# Altium schematic sheet JTAG_Flash_Update.SchDoc
size 420 x 297 mm; CompanyName: WUT ISE; Organization: WUT ISE; DocumentNumber: 11; SheetNumber: 9; Title2: JTAG, Flash & update interface; EDA_Number: ARTIQ; ModifiedDate: -
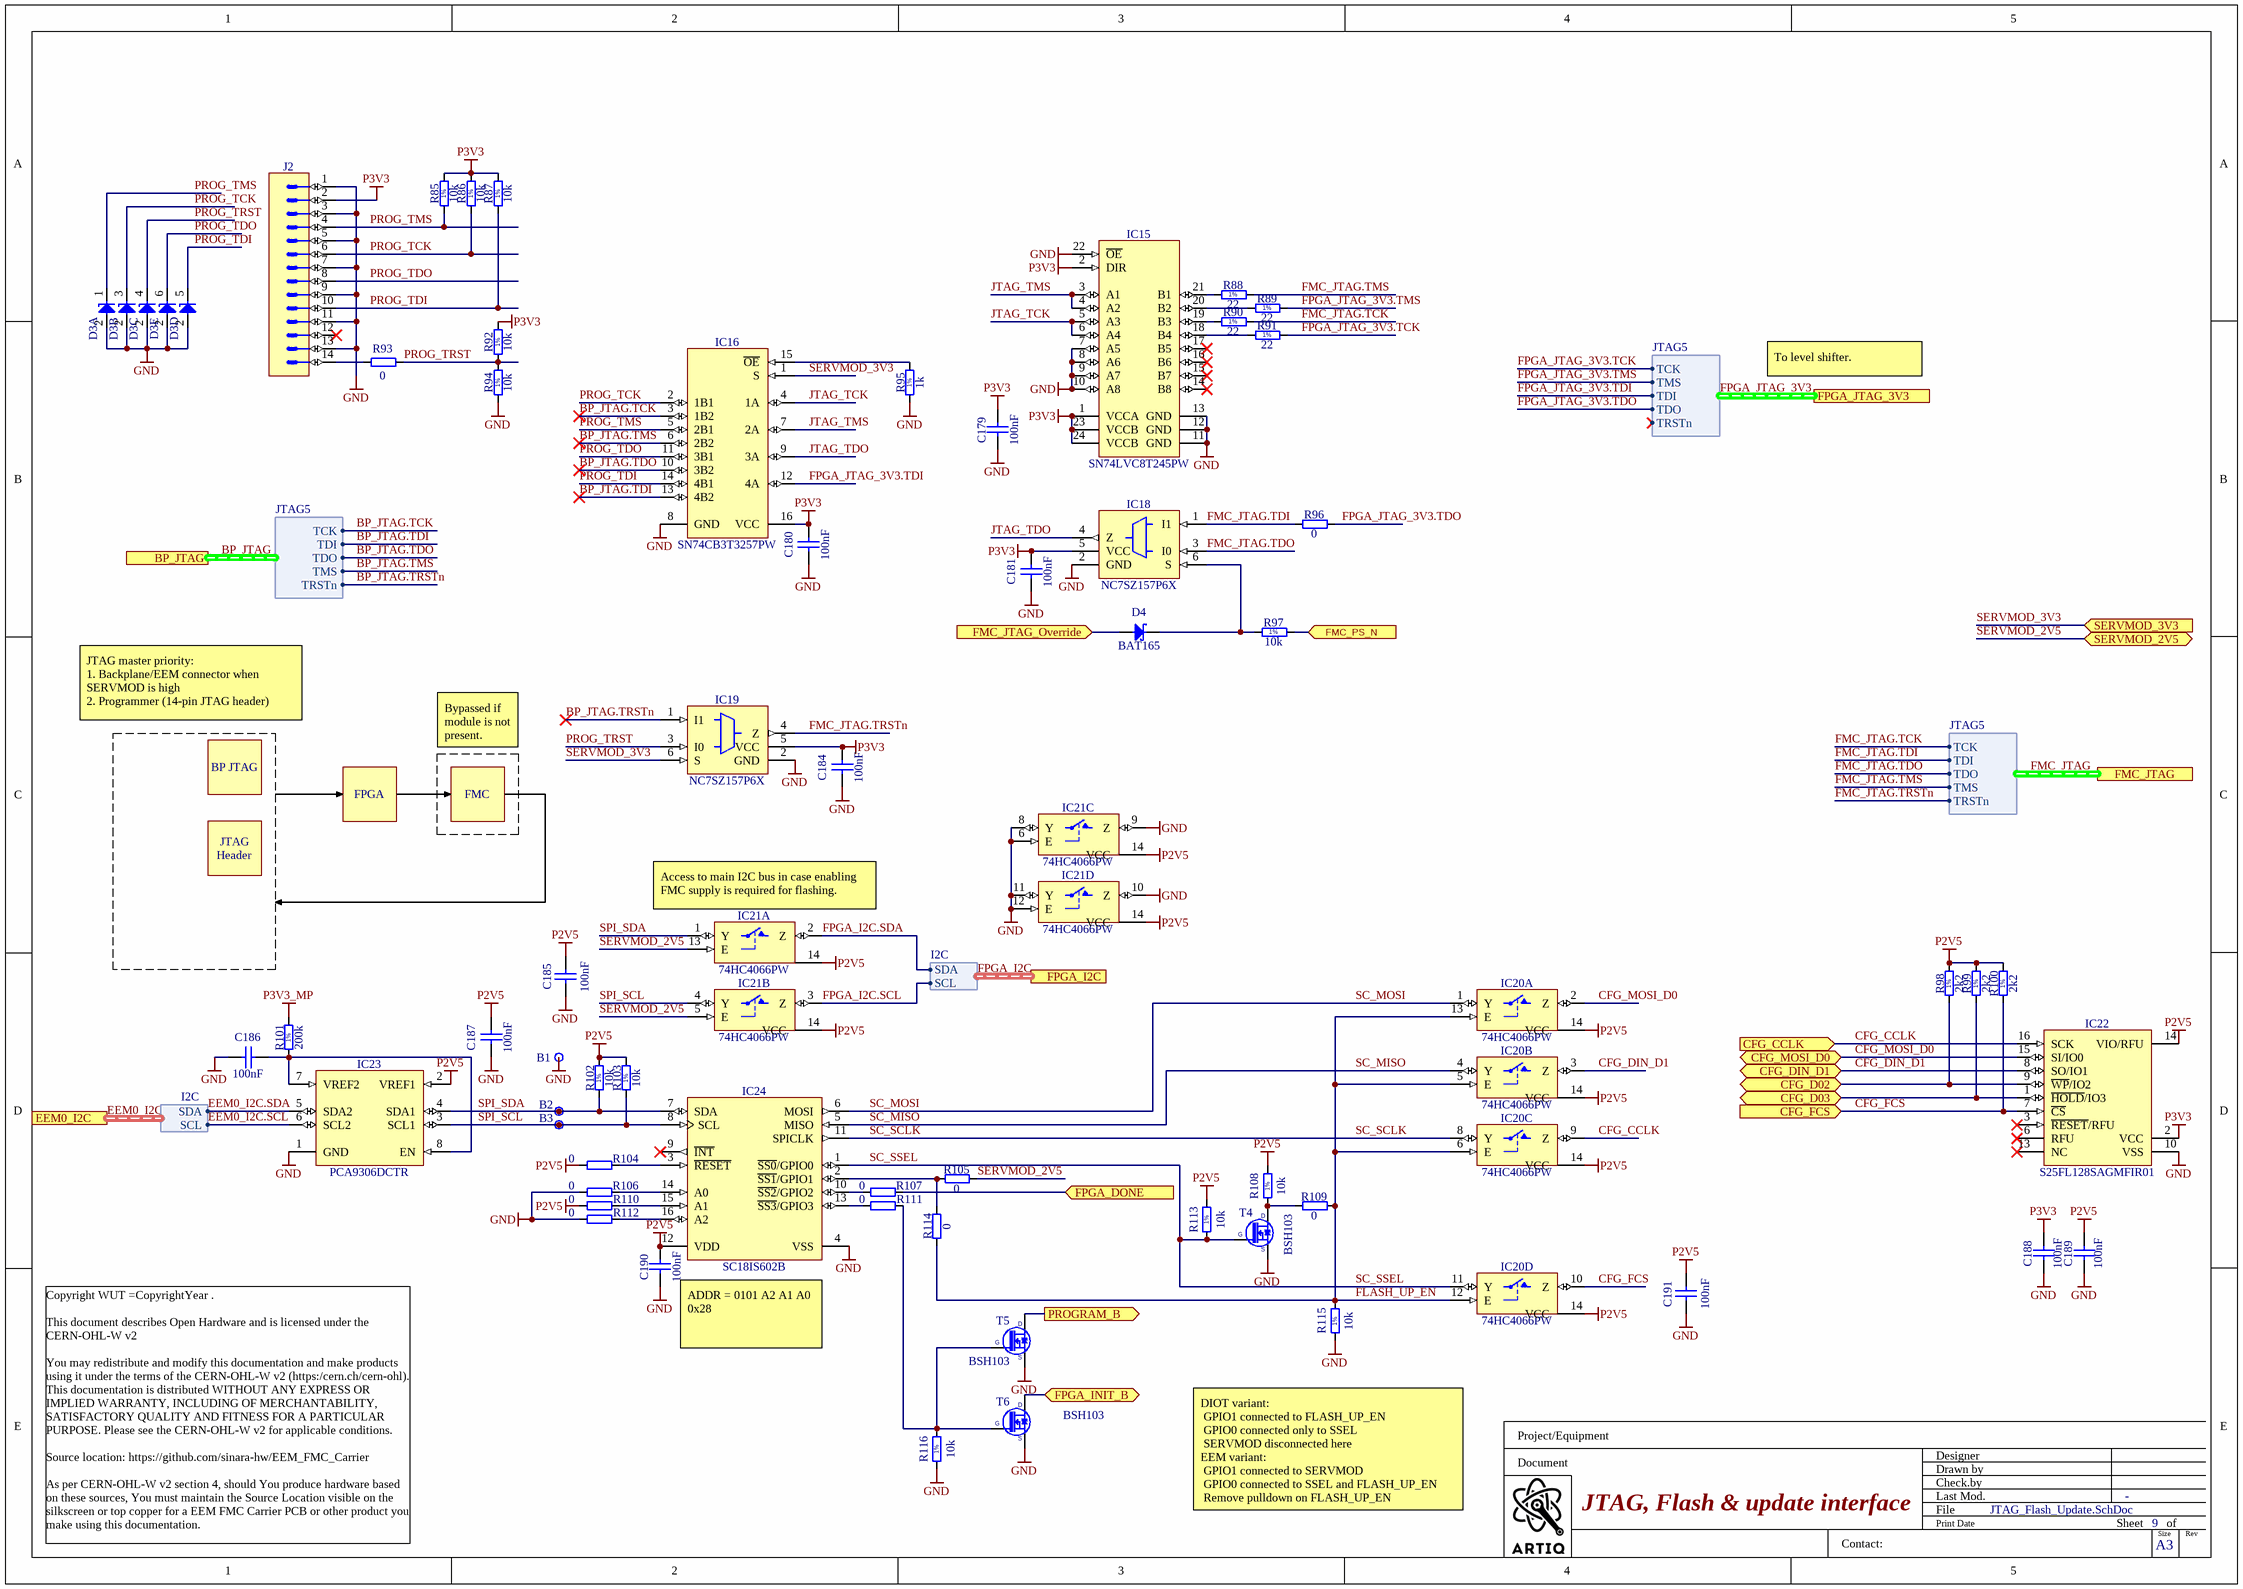
[diagram p0: JTAG_Flash_Update.SchDoc]

## Parts
B1  Plated Hole  [c150h100]  (value not drawn)  (no BOM)
B2  Test Point  [TPS127]  (value not drawn)  (no BOM)
B3  Test Point  [TPS127]  (value not drawn)  (no BOM)
C179  100nF  [CAPC1005X55N]
C180  100nF  [CAPC1005X55N]
C181  100nF  [CAPC1005X55N]
C184  100nF  [CAPC1005X55N]
C185  100nF  [CAPC1005X55N]
C186  100nF  [CAPC1005X55N]
C187  100nF  [CAPC1005X55N]
C188  100nF  [CAPC0603X33N]
C189  100nF  [CAPC0603X33N]
C190  100nF  [CAPC1005X55N]
C191  100nF  [CAPC1005X55N]
D3  PESD3V3L5UY  [SOT65P210X110-6N]  (value not drawn)  (parts A,B,C,D,E of 5)
D4  BAT165  [SOD2512X110N]
IC15  SN74LVC8T245PW  [SOP65P640X120-24N]
IC16  SN74CB3T3257PW  [SOP65P640X120-16N]
IC18  NC7SZ157P6X  [SOT65P210X110-6N]
IC19  NC7SZ157P6X  [SOT65P210X110-6N]
IC20  74HC4066PW  [SOP65P640X110-14N]  (parts A,B,C,D of 4)
IC21  74HC4066PW  [SOP65P640X110-14N]  (parts A,B,C,D of 4)
IC22  S25FL128SAGMFIR01  [SOIC127P1030X265-16N]
IC23  PCA9306DCTR  [SOP65P400X130-8N]
IC24  SC18IS602B  [SOP65P640X110-16N]
J2  Milli-Grid™  [MOLEX_87832-1420]  (value not drawn)
R85  10k  [RESC1005X40N]
R86  10k  [RESC1005X40N]
R87  10k  [RESC1005X40N]
R88  22  [RESC1005X40N]
R89  22  [RESC1005X40N]
R90  22  [RESC1005X40N]
R91  22  [RESC1005X40N]
R92  10k  [RESC1005X40N]
R93  0  [RESC1005X40N]
R94  10k  [RESC1005X40N]
R95  1k  [RESC1005X40N]
R96  0  [RESC1005X40N]
R97  10k  [RESC1005X40N]
R98  2k2  [RESC1005X40N]
R99  2k2  [RESC1005X40N]
R100  2k2  [RESC1005X40N]
R101  200k  [RESC1005X40N]
R102  10k  [RESC1005X40N]
R103  10k  [RESC1005X40N]
R104  0  [RESC1005X40N]
R105  0  [RESC1005X40N]
R106  0  [RESC1005X40N]
R107  0  [RESC1005X40N]
R108  10k  [RESC1005X40N]
R109  0  [RESC1005X40N]
R110  0  [RESC1005X40N]
R111  0  [RESC1005X40N]
R112  0  [RESC1005X40N]
R113  10k  [RESC1005X40N]
R114  0  [RESC1005X40N]
R115  10k  [RESC1005X40N]
R116  10k  [RESC1005X40N]
T4  BSH103  [SOT95P230X110-3N]
T5  BSH103  [SOT95P230X110-3N]
T6  BSH103  [SOT95P230X110-3N]

## Ports
BP_JTAG (harness JTAG5), CFG_CCLK (in), CFG_D02 (bidir), CFG_D03 (bidir), CFG_DIN_D1 (bidir), CFG_FCS (in), CFG_MOSI_D0 (bidir), EEM0_I2C (harness I2C), FMC_JTAG (harness JTAG5), FMC_JTAG_Override (in), FMC_PS_N (in), FPGA_DONE (in), FPGA_I2C (harness I2C), FPGA_INIT_B (bidir), FPGA_JTAG_3V3 (harness JTAG5), PROGRAM_B (out), SERVMOD_2V5 (bidir), SERVMOD_3V3 (in)

## Harnesses
JTAG5: TCK, TDI, TDO, TMS, TRSTn
I2C: SDA, SCL

## Nets
GND: B1.1 C179.1 C180.1 C181.1 C184.1 C185.1 C186.1 C187.1 C188.1 C189.1 C190.1 C191.1 D3.2(A) IC15.7(A5) IC15.8(A6) IC15.9(A7) IC15.10(A8) IC15.11(GND) IC15.12(GND) IC15.13(GND) IC15.22(~{OE}) IC16.8(GND) IC18.2(GND) IC19.2(GND) IC20.7(GND) IC21.6(E) IC21.7(GND) IC21.8(Y) IC21.9(Z) IC21.10(Z) IC21.11(Y) IC21.12(E) IC22.10(VSS) IC23.1(GND) IC24.4(VSS) J2.1 J2.3 J2.5 J2.7 J2.9 J2.11 J2.13 R94.1 R95.1 R106.2 R112.2 R115.1 R116.1 T4.2(S) T5.2(S) T6.2(S)
P2V5: C185.2 C187.2 C189.2 C190.2 C191.2 IC20.14(VCC) IC21.14(VCC) IC22.14(VIO/RFU) IC23.2(VREF1) IC24.12(VDD) R98.2 R99.2 R100.2 R102.2 R103.2 R104.2 R108.2 R110.2 R113.2
P3V3: C179.2 C180.2 C181.2 C184.2 C188.2 IC15.1(VCCA) IC15.2(DIR) IC15.23(VCCB) IC15.24(VCCB) IC16.16(VCC) IC18.5(VCC) IC19.5(VCC) IC22.2(VCC) J2.2 R85.2 R86.2 R87.2 R92.2
P3V3_MP: R101.2
BP_JTAG.TCK: IC16.3(1B2) ; port BP_JTAG.TCK
BP_JTAG.TDI: IC16.13(4B2) ; port BP_JTAG.TDI
BP_JTAG.TDO: IC16.10(3B2) ; port BP_JTAG.TDO
BP_JTAG.TMS: IC16.6(2B2) ; port BP_JTAG.TMS
BP_JTAG.TRSTn: IC19.1(I1) ; port BP_JTAG.TRSTn
CFG_CCLK: IC20.9(Z) IC22.16(SCK) ; port CFG_CCLK
CFG_D02: IC22.9(~{WP}/IO2) R98.1 ; port CFG_D02
CFG_D03: IC22.1(~{HOLD}/IO3) R99.1 ; port CFG_D03
CFG_DIN_D1: IC20.3(Z) IC22.8(SO/IO1) ; port CFG_DIN_D1
CFG_FCS: IC20.10(Z) IC22.7(~{CS}) R100.1 ; port CFG_FCS
CFG_MOSI_D0: IC20.2(Z) IC22.15(SI/IO0) ; port CFG_MOSI_D0
EEM0_I2C.SCL: IC23.6(SCL2) ; port EEM0_I2C.SCL
EEM0_I2C.SDA: IC23.5(SDA2) ; port EEM0_I2C.SDA
FLASH_UP_EN: IC20.5(E) IC20.6(E) IC20.12(E) IC20.13(E) R109.2 R114.1 R115.2
FMC_JTAG.TCK: R90.2 ; port FMC_JTAG.TCK
FMC_JTAG.TDI: IC18.1(I1) R96.2 ; port FMC_JTAG.TDI
FMC_JTAG.TDO: IC18.3(I0) ; port FMC_JTAG.TDO
FMC_JTAG.TMS: R88.2 ; port FMC_JTAG.TMS
FMC_JTAG.TRSTn: IC19.4(Z) ; port FMC_JTAG.TRSTn
FMC_JTAG_Override: D4.2(A) ; port FMC_JTAG_Override
FMC_PS_N: R97.2 ; port FMC_PS_N
FPGA_DONE: R107.1 ; port FPGA_DONE
FPGA_I2C.SCL: IC21.3(Z) ; port FPGA_I2C.SCL
FPGA_I2C.SDA: IC21.2(Z) ; port FPGA_I2C.SDA
FPGA_INIT_B: T6.3(D) ; port FPGA_INIT_B
FPGA_JTAG_3V3.TCK: R91.2 ; port FPGA_JTAG_3V3.TCK
FPGA_JTAG_3V3.TDI: IC16.12(4A) ; port FPGA_JTAG_3V3.TDI
FPGA_JTAG_3V3.TDO: R96.1 ; port FPGA_JTAG_3V3.TDO
FPGA_JTAG_3V3.TMS: R89.2 ; port FPGA_JTAG_3V3.TMS
JTAG_TCK: IC15.5(A3) IC15.6(A4) IC16.4(1A)
JTAG_TDO: IC16.9(3A) IC18.4(Z)
JTAG_TMS: IC15.3(A1) IC15.4(A2) IC16.7(2A)
PROG_TCK: D3.3(C) IC16.2(1B1) J2.6 R86.1
PROG_TDI: D3.5(C) IC16.14(4B1) J2.10 R87.1
PROG_TDO: D3.6(C) IC16.11(3B1) J2.8
PROG_TMS: D3.1(C) IC16.5(2B1) J2.4 R85.1
PROG_TRST: D3.4(C) IC19.3(I0) R92.1 R93.1 R94.2
PROGRAM_B: T5.3(D) ; port PROGRAM_B
SC_MISO: IC20.4(Y) IC24.5(MISO)
SC_MOSI: IC20.1(Y) IC24.6(MOSI)
SC_SCLK: IC20.8(Y) IC24.11(SPICLK)
SC_SSEL: IC20.11(Y) IC24.1(~{SS0}/GPIO0) R113.1 T4.1(G)
SERVMOD_2V5: IC21.5(E) IC21.13(E) R105.2 ; port SERVMOD_2V5
SERVMOD_3V3: IC16.1(S) IC19.6(S) ; port SERVMOD_3V3
SPI_SCL: B3.1 IC21.4(Y) IC23.3(SCL1) IC24.8(SCL) R103.1
SPI_SDA: B2.1 IC21.1(Y) IC23.4(SDA1) IC24.7(SDA) R102.1
NetC186_2: C186.2 IC23.7(VREF2) IC23.8(EN) R101.1
NetD4_1: D4.1(C) IC18.6(S) R97.1
NetIC15_18: IC15.18(B4) R91.1
NetIC15_19: IC15.19(B3) R90.1
NetIC15_20: IC15.20(B2) R89.1
NetIC15_21: IC15.21(B1) R88.1
NetIC16_15: IC16.15(~{OE}) R95.2
NetIC24_2: IC24.2(~{SS1}/GPIO1) R105.1 R114.2
NetIC24_3: IC24.3(~{RESET}) R104.1
NetIC24_10: IC24.10(~{SS2}/GPIO2) R107.2
NetIC24_13: IC24.13(~{SS3}/GPIO3) R111.2
NetIC24_14: IC24.14(A0) R106.1
NetIC24_15: IC24.15(A1) R110.1
NetIC24_16: IC24.16(A2) R112.1
NetJ2_14: J2.14 R93.2
NetR108_1: R108.1 R109.1 T4.3(D)
NetR111_1: R111.1 R116.2 T5.1(G) T6.1(G)

Not connected (* = marked no-connect by the designer): IC15 14(B8)* 15(B7)* 16(B6)* 17(B5)*; IC22 3(~{RESET}/RFU)* 6(RFU)* 13(NC)*; IC24 9(~{INT})*; J2 12*

## Buses and harness runs
harness BP_JTAG = port BP_JTAG
harness EEM0_I2C = port EEM0_I2C
harness FMC_JTAG = port FMC_JTAG
harness FPGA_I2C = port FPGA_I2C
harness FPGA_JTAG_3V3 = port FPGA_JTAG_3V3

## Notes on the sheet
- To level shifter.
- JTAG master priority:
  1. Backplane/EEM connector when SERVMOD is high
  2. Programmer (14-pin JTAG header)
- BP JTAG
- FPGA
- Bypassed if module is not present.
- FMC
- JTAG
- Header
- (near IC21) Access to main I2C bus in case enabling FMC supply is required for flashing.
- ADDR = 0101 A2 A1 A0
  0x28
- DIOT variant:
  GPIO1 connected to FLASH_UP_EN
  GPIO0 connected only to SSEL
  SERVMOD disconnected here
  EEM variant:
  GPIO1 connected to SERVMOD
  GPIO0 connected to SSEL and FLASH_UP_EN
  Remove pulldown on FLASH_UP_EN
- Project/Equipment
- Document
- Designer
- Drawn by
- Check.by
- Copyright WUT =CopyrightYear .
  This document describes Open Hardware and is licensed under the CERN-OHL-W v2
  You may redistribute and modify this documentation and make products using it under the terms of the CERN-OHL-W v2 (https:/cern.ch/cern-ohl). This documentation is distributed WITHOUT ANY EXPRESS OR IMPLIED WARRANTY, INCLUDING OF MERCHANTABILITY, SATISFACTORY QUALITY AND FITNESS FOR A PARTICULAR PURPOSE. Please see the CERN-OHL-W v2 for applicable conditions.
  Source location: https://github.com/sinara-hw/EEM_FMC_Carrier
  As per CERN-OHL-W v2 section 4, should You produce hardware based on these sources, You must maintain the Source Location visible on the silkscreen or top copper for a EEM FMC Carrier PCB or other product you make using this documentation.
- Contact:
- File
- Last Mod.
- Print Date
- Sheet
- Size
- A3
- of
- Rev
- (in symbol R0402_1K_1%_0.0625W_100PPM) 1%
- (in symbol R0402_2K2_1%_0.0625W_100PPM) 1%
- (in symbol R0402_10K_1%_0.0625W_100PPM) 1%
- (in symbol R0402_22R_1%_0.0625W_100PPM) 1%
- (in symbol R0402_200K_1%_0.0625W_100PPM) 1%

## Library data of the parts
B1 = PLATED_HOLE1.0_PAD1.5: Single Terminal Socket; Part Description: Plated Through Hole: Hole Dia.=1mm Pad Dia.=1.5mm,  IPC-7251 Level C; Mounted: No; Part Number: PLATED_HOLE1.0_PAD1.5; Component Type: Standard (No BOM); Pin Count: 1; Family: Plated Hole; Socket: No; SMD: No; Sense: No; Status: None; ComponentHeight: 0mm; HelpURL: Undefined; Author: CERN DEM JLC; CreateDate: 30.10.2008; LatestRevisionDate: 30.10.2008; PackageDescription: Plated Through Hole: Hole Dia.=1mm Pad Dia.=1.5mm,  IPC-7251 Level C
B2 B3 = SMD_PAD_1.27X1.27MM: Part Description: 1.27mm x 1.27mm PCB Copper Area (SMD Test Point); Mounted: No; Part Number: SMD_PAD_1.27X1.27MM; Component Type: Standard (No BOM); Pin Count: 1; Family: Test Point; Socket: No; SMD: No; Sense: No; Status: None; ComponentHeight: 0mm; HelpURL: Undefined; Author: CERN DEM JLC; CreateDate: 12.01.2008; LatestRevisionDate: 12.01.2008; PackageDescription: 1.27mm x 1.27mm PCB Copper Area (SMD Test Point)
C179-C181 C184 C186 C187 = CC0402_100NF_25V_10%_X7R_YUDEN_TMK105B7104KVHF: Non-polarised capacitor; Part Description: SMD Multilayer Chip Ceramic Capacitor (High Dielectric Type) for Automotive / Industrial Applications; Manufacturer: TAIYO YUDEN; Voltage: 25V; TC: X7R; Tolerance: ±10%; Part Number: CC0402_100NF_25V_10%_X7R_YUDEN_TMK105B7104KVHF; Component Kind: Standard; Component Type: Standard; Pin Count: 2; Value: 100nF; Status: Not Recommended; Manufacturer Part Number: TMK105B7104KVHF; Case: 0402; Mounted: Yes; Socket: No; SMD: Yes; Sense: No; HelpURL: \\cern.ch\dfs\Applications\Altium\Datasheets\CC0402_TAIYO-YUDEN_TMK105B7104KVHF.pdf; Author: CERN DEM JLC; CreateDate: 10-May-17; LatestRevisionDate: 10-May-17; ComponentHeight: 0.55mm
C185 C190 C191 = CC0402_100NF_16V_10%_X5R: Non-polarised capacitor; Part Description: SMD Multilayer Chip Ceramic Capacitor; Manufacturer: GENERIC; Manufacturer1 Part Number: GRM155R61C104KA88D; Voltage: 16V; TC: X5R; Tolerance: ±10%; Part Number: CC0402_100NF_16V_10%_X5R; Component Kind: Standard; Component Type: Standard; Pin Count: 2; Value: 100nF; Status: None; Manufacturer Part Number: CC0402_100NF_16V_10%_X5R; Case: 0402; Mounted: Yes; Socket: No; SMD: Yes; Sense: No; Manufacturer1 Example: MURATA; Manufacturer1 ComponentHeight: 0.55mm; HelpURL: \\cern.ch\dfs\Applications\Altium\Datasheets\CC0402_X5R_MURATA_GRM.pdf; Author: CERN DEM JLC; CreateDate: 10.12.2013; LatestRevisionDate: 10.12.2013
C188 C189 = CC0201_100NF_6.3V_10%_X5R: Non-polarised capacitor; Part Description: SMD Multilayer Chip Ceramic Capacitor; Manufacturer: GENERIC; Manufacturer1 Part Number: 02016D104KAT2A; Voltage: 6.3V; TC: X5R; Tolerance: ±10%; Part Number: CC0201_100NF_6.3V_10%_X5R; Component Kind: Standard; Component Type: Standard; Pin Count: 2; Value: 100nF; Status: Not Recommended; Manufacturer Part Number: CC0201_100NF_6.3V_10%_X5R; Case: 0201; Mounted: Yes; Socket: No; SMD: Yes; Sense: No; Manufacturer1 Example: AVX; Manufacturer1 ComponentHeight: 0.33mm; HelpURL: \\cern.ch\dfs\Applications\Altium\Datasheets\CC0201_X5R_AVX.pdf; Author: CERN DEM JLC; CreateDate: 03.12.2007; LatestRevisionDate: 03.12.2007; ClassName: Artix
D3 = PESD3V3L5UY: Fivefold ESD Protection Diode Arrays; Part Description: Fivefold ESD Protection Diode Arrays (30kV); Manufacturer: NEXPERIA; Voltage: 3.3V; Power: 200W; PressFit: No; Bonding: No; Part Number: PESD3V3L5UY; Component Kind: Standard; Component Type: Standard; Device: PESD3V3L5UY; PackageDescription: SOT363, SC-88, 0.65mm Pitch; 6 Pin, 1.25mm W X 2.00mm L X 1.10mm H body, IPC Medium Density; Manufacturer Part Number: PESD3V3L5UY; Pin Count: 6; Case: SOT363; Mounted: Yes; Socket: No; SMD: Yes; Sense: No; ComponentHeight: 1.1mm; HelpURL: \\cern.ch\dfs\Applications\Altium\Datasheets\PESD3V3L5UY.pdf; Author: CERN DEM WB; CreateDate: 05.07.2021; LatestRevisionDate: 05.07.2021
D4 = BAT165: Schottky Diode; Manufacturer: INFINEON; Part Description: Medium Power AF Schottky Diode; Voltage: 40V; Power: 750mA; PressFit: No; Bonding: No; Manufacturer Part Number: BAT165; PackageDescription: Small Outline Diode (SOD-323), 1.70mm W X 1.25mm L X 1.10mm H body,  IPC Medium Density; Part Number: BAT165; Component Kind: Standard; Component Type: Standard; Device: BAT165; Pin Count: 2; Case: SOD323; Mounted: Yes; Socket: No; SMD: Yes; Sense: No; ComponentHeight: 1.1mm; HelpURL: \\cern.ch\dfs\Applications\Altium\Datasheets\BAT165.pdf; Author: CERN DEM JLC; CreateDate: 12.11.2014; LatestRevisionDate: 12.11.2014
IC15 = SN74LVC8T245PW: 8-Bit Dual-Supply Bus Transceiver With Configurable Voltage Translation and 3-State Outputs; Manufacturer: TEXAS INSTRUMENTS; PressFit: No; Bonding: No; Part Number: SN74LVC8T245PW; Component Kind: Standard; Component Type: Standard; Device: SN74LVC8T245PW; PackageDescription: SOP, 0.65mm Pitch; 24 Pin, 4.40mm W X 7.80mm L X 1.20mm H Body, IPC Medium Density; Part Description: 8-Bit Dual-Supply Bus Transceiver With Configurable Voltage Translation and 3-State Outputs; Manufacturer Part Number: SN74LVC8T245PW; Pin Count: 24; Case: TSSOP24; Mounted: Yes; Socket: No; SMD: Yes; Sense: No; ComponentHeight: 1.2mm; Author: CERN DEM JLC; HelpURL: \\cern.ch\dfs\Applications\Altium\Datasheets\SN74LVC8T245PW.pdf; CreateDate: 02.09.2009; LatestRevisionDate: 02.09.2009
IC16 = SN74CB3T3257PW: 4-BIT 1-OF-2 FET Multiplexer/Demultiplexer 2.5V/3.3V Low-Voltage Bus Switch 5V Tolerant Shifter; Manufacturer: TEXAS INSTRUMENTS; PressFit: No; Bonding: No; Part Number: SN74CB3T3257PW; Component Kind: Standard; Component Type: Standard; Device: SN74CB3T3257PW; PackageDescription: SOP, 0.65mm Pitch; 16 Pin, 4.40mm W X 5.00mm L X 1.20mm H body, IPC Medium Density; Part Description: 4-Bit 1-of-2 FET Multiplexer/Demultiplexer 2.5V/3.3V Low-Voltage Bus Switch 5V Tolerant Shifter; Manufacturer Part Number: SN74CB3T3257PW; Pin Count: 16; Case: TSSOP16; Mounted: Yes; Socket: No; SMD: Yes; Sense: No; ComponentHeight: 1.2mm; Author: CERN DEM JLC; HelpURL: \\cern.ch\dfs\Applications\Altium\Datasheets\SN74CB3T3257PW.pdf; CreateDate: 2012-01-30; LatestRevisionDate: 2012-01-30
IC18 IC19 = NC7SZ157P6X: TinyLogic® UHS 2-Input Non-Inverting Multiplexer; Manufacturer: FAIRCHILD SEMICONDUCTOR; PressFit: No; Bonding: No; Manufacturer Part Number: NC7SZ157P6X; PackageDescription: SOT363, 0.65mm pitch; 6 pin, 1.40mm W X 2.15mm L, IPC Medium Density; Part Description: TinyLogic® UHS 2-Input Non-Inverting Multiplexer; Part Number: NC7SZ157P6X; Component Kind: Standard; Component Type: Standard; Device: NC7SZ157P6X; Pin Count: 6; Case: SOT363; Mounted: Yes; Socket: No; SMD: Yes; Sense: No; ComponentHeight: 1.1mm; Author: CERN DEM JLC; HelpURL: \\cern.ch\dfs\Applications\Altium\Datasheets\NC7SZ157P6X.pdf; CreateDate: 22.03.2012; LatestRevisionDate: 22.03.2012
IC20 IC21 = 74HC4066PW: Part Description: Quad Single-Pole Single-Throw Analog Switch; Manufacturer: NXP SEMICONDUCTORS; PressFit: No; Bonding: No; Table: Standard Logic; Part Number: 74HC4066PW; Component Kind: Standard; Component Type: Standard; Device: 74HC4066PW; PackageDescription: SOP, 14-Leads, Body 4.4x5mm (max), Pitch 0.65mm, IPC Medium Density; Manufacturer Part Number: 74HC4066PW; Pin Count: 14; Case: TSSOP14; Mounted: Yes; Socket: No; SMD: Yes; ComponentHeight: 1.1mm; Author: CERN DEM JLC; HelpURL: \\cern.ch\dfs\Applications\Altium\Datasheets\74HC4066PW.pdf; CreateDate: 2014-11-19; LatestRevisionDate: 2014-11-19
IC22 = S25FL128SAGMFIR01: 128Mbit, MirrorBit® Flash Non-Volatile Memory CMOS 3.0 Volt Core with Versatile I/O Serial Peripheral Interface with Multi-I/O; Part Description: 128Mbit, 133MHz, MirrorBit® Flash Non-Volatile Memory CMOS 3V Core with Versatile I/O Serial Peripheral Interface with Multi-I/O; Manufacturer: SPANSION; PressFit: No; Bonding: No; Part Number: S25FL128SAGMFIR01; Component Kind: Standard; Component Type: Standard; Device: S25FL128SAGMFIR01; PackageDescription: SOIC 16, Pitch 1.27mm - Body 7.5x10.3mm, IPC Medium Density; Manufacturer Part Number: S25FL128SAGMFIR01; Pin Count: 11; Case: SOIC16; Mounted: Yes; Socket: No; SMD: Yes; Sense: No; ComponentHeight: 2.65mm; HelpURL: \\cern.ch\dfs\Applications\Altium\Datasheets\S25FL128SAGMFIR01.pdf; Author: CERN DEM JLC; CreateDate: 2014-07-10; LatestRevisionDate: 2014-07-10
IC23 = PCA9306DCTR: Dual Bidirectional I2C Bus And SMBus Voltage-Level Translator; Manufacturer: TEXAS INSTRUMENTS; PressFit: No; Bonding: No; Part Number: PCA9306DCTR; Component Kind: Standard; Component Type: Standard; Device: PCA9306DCTR; PackageDescription: SOP, 0.65mm, Pitch; 8 Pin, 2.80mm W X 2.95mm L X 1.30mm H Body, PC Medium Density; Part Description: Dual Bidirectional I2C Bus And SMBus Voltage-Level Translator; Manufacturer Part Number: PCA9306DCTR; Pin Count: 8; Case: SSOP8; Mounted: Yes; Socket: No; SMD: Yes; Sense: No; ComponentHeight: 1.3mm; Author: CERN DEM JLC; HelpURL: \\cern.ch\dfs\Applications\Altium\Datasheets\PCA9306DCTR.pdf; CreateDate: 25.02.2013; LatestRevisionDate: 11.02.2016
IC24 = SC18IS602B: I2C-bus to SPI bridge; Manufacturer: NXP SEMICONDUCTORS; PressFit: No; Bonding: No; Part Number: SC18IS602B; Component Kind: Standard; Component Type: Standard; Device: SC18IS602B; PackageDescription: SOP, 0.65mm pitch; 16 pin, 4.40mm W X 5.00mm L X 1.10mm H body IPC Medium Density; Part Description: I2C-Bus to SPI Bridge; Manufacturer Part Number: SC18IS602B; Pin Count: 16; Case: TSSOP16; Mounted: Yes; Socket: No; SMD: Yes; Sense: No; ComponentHeight: 1.1mm; HelpURL: \\cern.ch\dfs\Applications\Altium\Datasheets\SC18IS602B.pdf; Author: CERN DEM MR; CreateDate: 14/12/2015; LatestRevisionDate: 14/12/2015
J2 = MOLEX_87832-1420: Connector 14 Male; Part Description: 2.00mm (.079") Pitch Milli-Grid™ Header, Surface Mount, Vertical, Shrouded, 14 Circuits,with Locking Windows and Centre Polarization Slot, PCB Locator; Manufacturer: MOLEX; PressFit: No; Part Number: MOLEX_87832-1420; Component Kind: Standard; Component Type: Standard; Pin Count: 14; Family: Milli-Grid™; Mounted: Yes; Socket: No; SMD: Yes; Sense: No; Status: None; Manufacturer Part Number: 87832-1420; ComponentHeight: 7.6mm; HelpURL: \\cern.ch\dfs\Applications\Altium\Datasheets\MOLEX_87832-1420.pdf; Author: CERN DEM JLC; CreateDate: 09.09.2008; LatestRevisionDate: 09.09.2008
R85-R87 R92 R94 R102 R103 = R0402_10K_1%_0.0625W_100PPM: Resistor - 1%; Part Description: General Purpose Thick Film Chip Resistor; Manufacturer: GENERIC; Manufacturer1 Part Number: 232270671003L; TC: ±100ppm/°C; PressFit: No; Part Number: R0402_10K_1%_0.0625W_100PPM; Component Kind: Standard; Component Type: Standard; Pin Count: 2; Value: 10k; Status: Not Recommended; Power: 0.0625W; Tolerance: ±1%; Manufacturer Part Number: R0402_10K_1%_0.0625W_100PPM; Case: 0402; Mounted: Yes; Sense: No; Socket: No; SMD: Yes; Manufacturer1 Example: YAGEO PHYCOMP; Manufacturer1 ComponentHeight: 0.4mm; HelpURL: \\cern.ch\dfs\Applications\Altium\Datasheets\R0402_Phycomp_RC0402.pdf; Author: CERN DEM JLC; CreateDate: 2007-12-03; LatestRevisionDate: 2012-10-17
R88-R91 = R0402_22R_1%_0.0625W_100PPM: Resistor - 1%; Part Description: General Purpose Thick Film Chip Resistor; Manufacturer: GENERIC; Manufacturer1 Part Number: 232270672209L; TC: ±100ppm/°C; PressFit: No; Part Number: R0402_22R_1%_0.0625W_100PPM; Component Kind: Standard; Component Type: Standard; Pin Count: 2; Value: 22; Status: Not Recommended; Power: 0.0625W; Tolerance: ±1%; Manufacturer Part Number: R0402_22R_1%_0.0625W_100PPM; Case: 0402; Mounted: Yes; Sense: No; Socket: No; SMD: Yes; Manufacturer1 Example: YAGEO PHYCOMP; Manufacturer1 ComponentHeight: 0.4mm; HelpURL: \\cern.ch\dfs\Applications\Altium\Datasheets\R0402_Phycomp_RC0402.pdf; Author: CERN DEM JLC; CreateDate: 03-Dec-07; LatestRevisionDate: 17-Oct-12
R93 R96 = R0402_0R_JUMPER: Resistor; Manufacturer: GENERIC; Part Description: 1A (0.05R Max DC Resistance) Zero Ohm Jumper; Manufacturer1 Part Number: 232270591001L; PressFit: No; Manufacturer Part Number: R0402_0R_JUMPER; Part Number: R0402_0R_JUMPER; Value: 0; Component Kind: Standard; Component Type: Standard; Pin Count: 2; Status: Not Recommended; Case: 0402; Mounted: Yes; Sense: No; Socket: No; SMD: Yes; Manufacturer1 Example: YAGEO PHYCOMP; Manufacturer1 ComponentHeight: 0.4mm; HelpURL: \\cern.ch\dfs\Applications\Altium\Datasheets\R0402_Phycomp_RC0402.pdf; Author: CERN DEM JLC; CreateDate: 03.12.2007; LatestRevisionDate: 17.10.2012
R95 = R0402_1K_1%_0.0625W_100PPM: Resistor - 1%; Part Description: General Purpose Thick Film Chip Resistor; Manufacturer: GENERIC; Manufacturer1 Part Number: 232270671002L; TC: ±100ppm/°C; PressFit: No; Part Number: R0402_1K_1%_0.0625W_100PPM; Component Kind: Standard; Component Type: Standard; Pin Count: 2; Value: 1k; Status: Not Recommended; Power: 0.0625W; Tolerance: ±1%; Manufacturer Part Number: R0402_1K_1%_0.0625W_100PPM; Case: 0402; Mounted: Yes; Sense: No; Socket: No; SMD: Yes; Manufacturer1 Example: YAGEO PHYCOMP; Manufacturer1 ComponentHeight: 0.4mm; HelpURL: \\cern.ch\dfs\Applications\Altium\Datasheets\R0402_Phycomp_RC0402.pdf; Author: CERN DEM JLC; CreateDate: 2007-12-03; LatestRevisionDate: 2012-10-17
R97 = R0402_10K_1%_0.0625W_100PPM: Resistor - 1%; Manufacturer: GENERIC; Part Description: General Purpose Thick Film Chip Resistor; Manufacturer1 Part Number: 232270671003L; TC: ±100ppm/°C; PressFit: No; Manufacturer Part Number: R0402_10K_1%_0.0625W_100PPM; Part Number: R0402_10K_1%_0.0625W_100PPM; Tolerance: ±1%; Value: 10k; Component Kind: Standard; Component Type: Standard; Pin Count: 2; Status: Not Recommended; Power: 0.0625W; Case: 0402; Mounted: Yes; Sense: No; Socket: No; SMD: Yes; Manufacturer1 Example: YAGEO PHYCOMP; Manufacturer1 ComponentHeight: 0.4mm; HelpURL: \\cern.ch\dfs\Applications\Altium\Datasheets\R0402_Phycomp_RC0402.pdf; Author: CERN DEM JLC; CreateDate: 03.12.2007; LatestRevisionDate: 17.10.2012
R98-R100 = R0402_2K2_1%_0.0625W_100PPM: Resistor - 1%; Part Description: General Purpose Thick Film Chip Resistor; Manufacturer: GENERIC; Manufacturer1 Part Number: 232270672202L; TC: ±100ppm/°C; PressFit: No; Part Number: R0402_2K2_1%_0.0625W_100PPM; Component Kind: Standard; Component Type: Standard; Pin Count: 2; Value: 2k2; Status: Not Recommended; Power: 0.0625W; Tolerance: ±1%; Manufacturer Part Number: R0402_2K2_1%_0.0625W_100PPM; Case: 0402; Mounted: Yes; Sense: No; Socket: No; SMD: Yes; Manufacturer1 Example: YAGEO PHYCOMP; Manufacturer1 ComponentHeight: 0.4mm; HelpURL: \\cern.ch\dfs\Applications\Altium\Datasheets\R0402_Phycomp_RC0402.pdf; Author: CERN DEM JLC; CreateDate: 03.12.2007; LatestRevisionDate: 17.10.2012; ClassName: Artix
R101 = R0402_200K_1%_0.0625W_100PPM: Resistor - 1%; Part Description: General Purpose Thick Film Chip Resistor; Manufacturer: GENERIC; Manufacturer1 Part Number: 232270672004L; TC: ±100ppm/°C; PressFit: No; Part Number: R0402_200K_1%_0.0625W_100PPM; Component Kind: Standard; Component Type: Standard; Pin Count: 2; Value: 200k; Status: Not Recommended; Power: 0.0625W; Tolerance: ±1%; Manufacturer Part Number: R0402_200K_1%_0.0625W_100PPM; Case: 0402; Mounted: Yes; Sense: No; Socket: No; SMD: Yes; Manufacturer1 Example: YAGEO PHYCOMP; Manufacturer1 ComponentHeight: 0.4mm; HelpURL: \\cern.ch\dfs\Applications\Altium\Datasheets\R0402_Phycomp_RC0402.pdf; Author: CERN DEM JLC; CreateDate: 03.12.2007; LatestRevisionDate: 17.10.2012
R104-R107 R109-R112 R114 = R0402_0R_JUMPER: Resistor; Part Description: 1A (0.05R Max DC Resistance) Zero Ohm Jumper; Manufacturer: GENERIC; Manufacturer1 Part Number: 232270591001L; PressFit: No; Part Number: R0402_0R_JUMPER; Component Kind: Standard; Component Type: Standard; Pin Count: 2; Value: 0; Status: Not Recommended; Manufacturer Part Number: R0402_0R_JUMPER; Case: 0402; Mounted: Yes; Socket: No; SMD: Yes; Manufacturer1 Example: YAGEO PHYCOMP; Manufacturer1 ComponentHeight: 0.4mm; HelpURL: \\cern.ch\dfs\Applications\Altium\Datasheets\R0402_Phycomp_RC0402.pdf; Author: CERN DEM JLC; CreateDate: 03.12.2007; LatestRevisionDate: 17.10.2012; Sense: No
R108 R113 R115 R116 = R0402_10K_1%_0.0625W_100PPM: Resistor - 1%; Part Description: General Purpose Thick Film Chip Resistor; Manufacturer: GENERIC; Manufacturer1 Part Number: 232270671003L; TC: ±100ppm/°C; Table: Resistors SMD; Part Number: R0402_10K_1%_0.0625W_100PPM; Component Kind: Standard; Component Type: Standard; Pin Count: 2; Value: 10k; Status: Not recommended; Power: 0.0625W; Tolerance: ±1%; Manufacturer Part Number: R0402_10K_1%_0.0625W_100PPM; Case: 0402; Mounted: Yes; Socket: No; SMD: Yes; Manufacturer1 Example: YAGEO PHYCOMP; Manufacturer1 ComponentHeight: 0.4mm; HelpURL: \\cern.ch\dfs\Applications\Altium\Datasheets\R0402_Phycomp_RC0402.pdf; Author: CERN DEM JLC; CreateDate: 2007-12-03; LatestRevisionDate: 2012-10-17
T4-T6 = BSH103: N-CHANNEL MOSFET WITH DIODE; Part Description: 30V 850mA N-Channel Enhancement Mode Field-Effect Transistor; Manufacturer: NEXPERIA; PressFit: No; Bonding: No; Part Number: BSH103; Component Kind: Standard; Component Type: Standard; Device: BSH103; PackageDescription: SOT23, 0.95mm Pitch; 3 Pin, 1.30mm W X 2.90mm L X 1.10mm H body, IPC Medium Density; Manufacturer Part Number: BSH103; Pin Count: 3; Case: SOT23-3; Mounted: Yes; Socket: No; SMD: Yes; Sense: No; ComponentHeight: 1.1mm; HelpURL: \\cern.ch\dfs\Applications\Altium\Datasheets\BSH103.pdf; Author: CERN DEM JLC; CreateDate: 16.03.2010; LatestRevisionDate: 20.06.2017